# Altium schematic sheet Hotswap.SchDoc
size A4; SheetNumber: 1; SheetTotal: 1
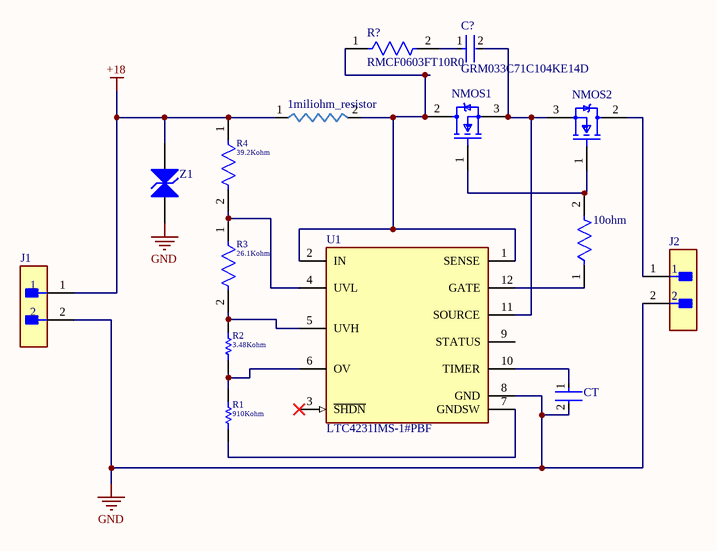
[diagram p0: Hotswap.SchDoc]

## Parts
1miliohm_resistor  WSR51L000FEA  [Resistor]  (value not drawn)
10ohm  RMCF0603FT10R0  [FP-RMCF0603-IPC_B]  (value not drawn)
C?  GRM033C71C104KE14D  [FP-GRM033-0_03-IPC_A]
CT  GRM21BZ71H475ME15K  [FP-GRM21B-0_2-e0_2_0_7-IPC_A]  (value not drawn)
J1  B2B-XH-A(LF)(SN)  [FP-B2B-XH-A_LF_SN-MFG]  (value not drawn)
J2  B2B-XH-A(LF)(SN)  [FP-B2B-XH-A_LF_SN-MFG]  (value not drawn)
NMOS1  IRF2204PBF  [FP-PG-TO220-3-MFG]  (value not drawn)
NMOS2  IRF2204PBF  [FP-PG-TO220-3-MFG]  (value not drawn)
R1  910Kohm  [RESC0603X26X15NL03T05]
R2  3.48Kohm  [RESC0201(0603)_L]
R3  26.1Kohm  [FP-RMCF0603-IPC_B]
R4  39.2Kohm  [FP-RN73R2B-MFG]
R?  RMCF0603FT10R0  [FP-RMCF0603-IPC_B]
U1  LTC4231IMS-1#PBF  [FP-MS-12-05-08-1668-IPC_B]
Z1  SMBJ24CA-E3/52  [VISH-DO-214AA-A-2_V]  (value not drawn)

## Nets
+18: 1miliohm_resistor.1 J1.1 R4.1 Z1.2(A)
GND: CT.2 J1.2 J2.2 U1.8(GND) Z1.1(A)
Net1miliohm_resistor_2: 1miliohm_resistor.2 NMOS1.2(D) R?.1 U1.1(SENSE) U1.2(IN)
Net10ohm_1: 10ohm.1 U1.12(GATE)
Net10ohm_2: 10ohm.2 NMOS1.1(G) NMOS2.1(G)
NetC?_1: C?.1 R?.2
NetC?_2: C?.2 NMOS1.3(S) NMOS2.3(S) U1.11(SOURCE)
NetCT_1: CT.1 U1.10(TIMER)
NetJ2_1: J2.1 NMOS2.2(D)
NetR1_1: R1.1 R2.2 U1.6(OV)
NetR1_2: R1.2 U1.7(GNDSW)
NetR2_1: R2.1 R3.2 U1.5(UVH)
NetR3_1: R3.1 R4.2 U1.4(UVL)

Not connected (* = marked no-connect by the designer): U1 3(~{SHDN})* 9(STATUS)

## Library data of the parts
1miliohm_resistor = WSR51L000FEA: Fixed Resistor, Metal Strip, 5W, 0.001ohm, 0.07V, 1% +/-Tol, 750ppm/Cel, Surface Mount, 4527; Manufacturer: Vishay; Value: 1mΩ; Temperature Coefficient: 750ppm/°C; Working Voltage: 70mV; Supplier: DigiKey; Supplier Part Number: WSRC-.001CT-ND; Manufacturer Part Number: WSR51L000FEA; RoHS: Compliant; Category: Chip SMD Resistors; Stock: 2101; Pricing: 1=3.5, 10=2.354, 25=2.042, 50=1.8464, 100=1.6803, 250=1.49828, 500=1.38442 (USD); Case/Package: 4527; Case Code (Imperial): 4527; China RoHS: Compliant; Composition: Metal Element, Metal Strip; Contact Plating: Silver, Tin; Features: Automotive AEC-Q200, Moisture Resistant; Height: 2.41mm; Length: 11.557mm; Lifecycle Status: Production; Max Operating Temperature: 275°C; Max Power Dissipation: 5W; Min Operating Temperature: -65°C; Mounting Technology: Surface Mount; Number of Terminals: 2; Number of Terminations: 2; Power Dissipation: 5W; Power Rating: 5W; Radiation Hardening: No; REACH SVHC: Yes; Termination: SMD/SMT; Tolerance: 1%; Width: 6.98mm; ComponentLink1URL: https://datasheet.octopart.com:443/WSR51L000FEA-Vishay-datasheet-151891905.pdf?src-supplier=IHS; ComponentLink1Description: https://datasheet.octopart.com:443/WSR51L000FEA-Vishay-datasheet-151891905.pdf?src-supplier=IHS; ComponentLink2URL: https://datasheet.octopart.com:443/WSR51L000FEA-Vishay-datasheet-104525432.pdf?src-supplier=Future+Electronics; ComponentLink2Description: https://datasheet.octopart.com:443/WSR51L000FEA-Vishay-datasheet-104525432.pdf?src-supplier=Future+Electronics; ComponentLink3URL: https://datasheet.octopart.com:443/WSR51L000FEA-Vishay-datasheet-12538435.pdf?src-supplier=Factory+Futures; ComponentLink3Description: https://datasheet.octopart.com:443/WSR51L000FEA-Vishay-datasheet-12538435.pdf?src-supplier=Factory+Futures; ComponentLink4URL: https://datasheet.octopart.com:443/WSR51L000FEA-Vishay-datasheet-12525249.pdf?src-supplier=Factory+Futures; ComponentLink4Description: https://datasheet.octopart.com:443/WSR51L000FEA-Vishay-datasheet-12525249.pdf?src-supplier=Factory+Futures; ComponentLink5URL: https://datasheet.octopart.com:443/WSR51L000FEA-Vishay-datasheet-12509929.pdf?src-supplier=Factory+Futures; ComponentLink5Description: https://datasheet.octopart.com:443/WSR51L000FEA-Vishay-datasheet-12509929.pdf?src-supplier=Factory+Futures; ComponentLink6URL: https://datasheet.octopart.com:443/WSR51L000FEA-Vishay-datasheet-8877212.pdf?src-supplier=Factory+Futures; ComponentLink6Description: https://datasheet.octopart.com:443/WSR51L000FEA-Vishay-datasheet-8877212.pdf?src-supplier=Factory+Futures; ComponentLink7URL: https://datasheet.octopart.com:443/WSR51L000FEA-Vishay-datasheet-8374044.pdf?src-supplier=Factory+Futures; ComponentLink7Description: https://datasheet.octopart.com:443/WSR51L000FEA-Vishay-datasheet-8374044.pdf?src-supplier=Factory+Futures; ComponentLink8URL: https://datasheet.octopart.com:443/WSR51L000FEA-Vishay-datasheet-5320589.pdf?src-supplier=Factory+Futures; ComponentLink8Description: https://datasheet.octopart.com:443/WSR51L000FEA-Vishay-datasheet-5320589.pdf?src-supplier=Factory+Futures; ComponentLink9URL: http://sigma.octopart.com:80/rohs_statement/Vishay-company-15.pdf?src-supplier=Compliance+Statements; ComponentLink9Description: http://sigma.octopart.com:80/rohs_statement/Vishay-company-15.pdf?src-supplier=Compliance+Statements
10ohm R? = CMP-26527-005040-1: 10Ω ±1% 0.1W 0603 Thick Film Chip Resistor AEC-Q200 compliant; Max Power Dissipation: 100mW; Temperature Coefficient: 100ppm/°C; Resistance: 10R; Radiation Hardening: No; Military Standard: Not; Resistor Type: Thick Film; Case/Package: 0603; Case Code (Metric): 1608; Power Rating: 100mW; Min Operating Temperature: -55°C; Mount: Surface Mount; Width: 0.031inch; Packaging: Tape and Reel; Tolerance: 1%; Case Code (Imperial): 0603; Number of Terminations: 2; Height: 0.022inch; Features: Automotive AEC-Q200; Construction: Rectangular; Contact Plating: Tin; RoHS Compliant: Yes; Length: 1.55mm; Max Operating Temperature: 155°C; Depth: 0.8mm; Series: RMCF
C? = CMP-06035-019037-1: Chip Multilayer Ceramic Capacitors for General Purpose, 0201, 0.10uF, X7S, 22%, 10%, 16V; Capacitance: 100nF; Dielectric: X7S; Tolerance: 10%; Voltage Rating (DC): 16V; Height: 0.3mm; Max Operating Temperature: 125°C; Case Code (Metric): 0603; Termination: SMD/SMT; Min Operating Temperature: -55°C; Mount: Surface Mount; Case/Package: 0201; Weight: 1.2E-05oz; Package Quantity: 15000; Length: 0.024inch; Voltage Rating: 16V; Case Code (Imperial): 0201; Packaging: Tape and Reel; Thickness: 0.013inch; Width: 0.3mm
CT = CMP-06035-012295-1: Chip Multilayer Ceramic Capacitors for General Purpose, 0805, 4.7uF, X7R, 15%, 20%, 50V
J1 J2 = CMP-2000-05888-3: CONN HEADER VERT 2POS 2.5MM; Current Rating: 3A; Voltage Rating: 250V; Number of Contacts: 2; Contact Resistance: 20mR; Wire/Cable Gauge: 22AWG; Insulation Resistance: 1GR; Connector Type: Male Pin; Packaging: Bulk; Contact Material: Brass; Lead Free: Lead Free; Orientation: Straight; Contact Plating: Tin; Max Current Rating: 3A; Termination: Solder; Fastening Type: Detent; Depth: 5.75mm; Housing Material: Polyamide; REACH SVHC: No SVHC; Series: XH; Voltage Rating (AC): 250V; Number of Positions: 2; Color: Natural; Contact Type: Male Pin; Max Voltage Rating (DC): 250V; Pitch: 2.5mm; Lead Pitch: 2.5mm; Mount: Through Hole; Max Operating Temperature: 85°C; Length: 7.4mm; Max Voltage Rating (AC): 250V; Min Operating Temperature: -25°C; Number of Rows: 1; Housing Color: White
NMOS1 NMOS2 = CMP-00196-65873303-1: IRF2204PBF Mosfet, Power; N-ch; Vdss 40V; Rds(on) 3 Milliohms; Id 210A; TO-220AB; Pd 330W; Vf 1.3V; Drain to Source Resistance: 3mΩ; Turn-On Delay Time: 15ns; Fall Time: 110ns; Rds On Max: 3.6mΩ; Gate to Source Voltage (Vgs): 20V; Number of Channels: 1; Threshold Voltage: 4V; Rise Time: 140ns; Input Capacitance: 5.89nF; Turn-Off Delay Time: 62ns; Element Configuration: Single; Max Junction Temperature (Tj): 175°C; Resistance: 3.6Ω; Current Rating: 210A; Lead Free: Lead Free; Radiation Hardening: No; Lifecycle Status: Production; Drain to Source Voltage (Vdss): 40V; Packaging: Bulk; Mount: Through Hole; Schedule B: 8541290080, 8541290080|8541290080|8541290080|8541290080|8541290080; Power Dissipation: 330W; Length: 10.668mm; Number of Pins: 3; Height: 16.51mm; Package Quantity: 1000; REACH SVHC: No SVHC; Continuous Drain Current (ID): 210A; Max Power Dissipation: 330W; Min Operating Temperature: -55°C; Width: 4.826mm; Nominal Vgs: 4V; Max Operating Temperature: 175°C; On-State Resistance: 3.6mΩ; Dual Supply Voltage: 40V; Contact Plating: Tin; Voltage Rating (DC): 40V; RoHS: Compliant; NexarPartId: 65873303; Case/Package: TO-220AB; Number of Elements: 1; Drain to Source Breakdown Voltage: 40V
R1 = CMP-2004-03436-1: Manufacturer: Panasonic; Part Number: ERJ-1GNF9311C
R2 = CMP-1010-00475-1: 3K4 0.05W 1% 0201 (0603 Metric)  SMD; Case-Metric: 0603; Case-EIA: 0201; Value: 3400.00 Ohm; Technology: SMT; Tolerance: 1 %; Power: 0.05 W
R3 = CMP-26527-006949-1: 26.1kΩ ±1% 0.1W 0603 Thick Film Chip Resistor AEC-Q200 compliant; Temperature Coefficient: 100ppm/°C; Max Power Dissipation: 100mW; Resistance: 26.1kR; Width: 0.031inch; Case Code (Metric): 1608; Features: Automotive AEC-Q200; Case Code (Imperial): 0603; Packaging: Tape and Reel; Max Operating Temperature: 155°C; Resistor Type: Thick Film; Tolerance: 1%; RoHS Compliant: Yes; Min Operating Temperature: -55°C; Contact Plating: Tin; Number of Terminations: 2; Series: RMCF; Mount: Surface Mount; Height: 0.022inch; Radiation Hardening: No; Case/Package: 0603; Length: 0.061inch
R4 = CMP-04015-063809-1: 39.7kΩ ±1% 0.25W, 1/4W Chip Resistor 1206 (3216 Metric) Moisture Resistant Thin Film
U1 = CMP-09134-000018-1: IC HOT SWAP CTRLR GP 12MSOP; Number of Channels: 1; Max Supply Voltage: 36V; Min Supply Voltage: 2.7V; Operating Supply Current: 4uA; Packaging: Rail/Tube; Max Operating Temperature: 85°C; Case/Package: MSOP; REACH SVHC: No SVHC; Number of Pins: 12; RoHS Compliant: Yes; Features: Latched Fault; Min Operating Temperature: -40°C; Mount: Surface Mount
Z1 = CMP-2000-07094-1: TRANSZORB(R) Transient Voltage Suppressor, 24 V, -55 to 150 degC, 2-Pin DO-214AA (SMBJ), RoHS, Tape and Reel; Manufacturer: Vishay; Clamping Voltage Vc Max: 38.9V; Peak Pulse Current Ippm: 14A; Product Range: TRANSZORBSMBJSeries; Power Dissipation Pd: 600W; Breakdown Voltage Min: 26.7V; No. of Pins: 2Pins; SVHC: ToBeAdvised; Breakdown Voltage Max: 29.5V; TVS Polarity: Bidirectional; Reverse Stand-Off Voltage Vrwm: 24V; Mounting Technology: SurfaceMount; Package Reference: DO-214AA; Package Description: 2-Pin Surface Mount Device, Body 4.315 x 3.62 mm; Diode Case Style: DO-214AA; Packaging: CutTape; Datasheet URL: http://www.vishay.com/docs/88392/smbj50a.pdf; Peak Pulse Power Dissipation: 600W; Manufacturer URL: http://www.vishay.com/; Datasheet Version: 02/2014